# EAGLE schematic test_1 (EAGLE 7.0.0)

## Sheet 1 of 13
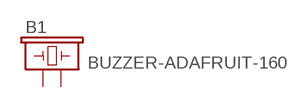
[diagram p0: schematic, sheet 1]

### Parts
B1  BUZZER-ADAFRUIT-160  [BUZZER-12MM-ADAFRUIT-160]

### Nets
2_0_buzzer: B1.- ; also sheet 2,3,4,6,7,8,9,10,11,12,13
D3_7_brain: B1.+ ; also sheet 8

## Sheet 2 of 13
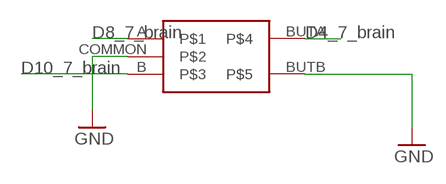
[diagram p1: schematic, sheet 2]

### Parts
U4  ROTARY-ENCODER-W/BUTTON-ADAFRUIT377  [ROTARY-ENCODER-W/BUTTON-ADAFRUIT377]

### Nets
2_0_buzzer: U4.BUTB U4.COMMON ; supply symbol labelled GND ; also sheet 1,3,4,6,7,8,9,10,11,12,13
D4_7_brain: U4.BUTA ; also sheet 8
D8_7_brain: U4.A ; also sheet 8
D10_7_brain: U4.B ; also sheet 8

## Sheet 3 of 13
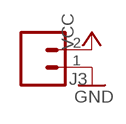
[diagram p2: schematic, sheet 3]

### Parts
J3  HEADER-0.1IN-2POS-FEMALE  [HDRV2W63P254_2X1_508X254H838_HS]

### Nets
2_0_buzzer: J3.1 ; supply symbol labelled GND ; also sheet 1,2,4,6,7,8,9,10,11,12,13
+5V_7_brain: J3.2 ; supply symbol labelled VCC ; also sheet 5,8,9,10,12

## Sheet 4 of 13
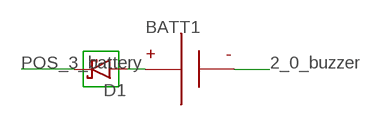
[diagram p3: schematic, sheet 4]

### Parts
BATT1  BATTERY-9V-VERTICAL  [BATTERY_9V_KEYSTONE_968]
D1  RESOLVED-DIODE-SCHOTTKY_TH-DO-41-AND-DO-204AL  [DIOAD1125W78L520D270_HS]

### Nets
2_0_buzzer: BATT1.N ; also sheet 1,2,3,6,7,8,9,10,11,12,13
N$1_3_battery: BATT1.P D1.A
POS_3_battery: D1.C ; also sheet 8

## Sheet 5 of 13
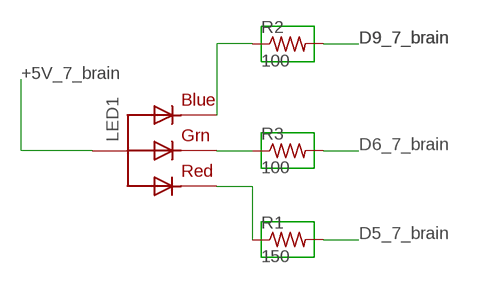
[diagram p4: schematic, sheet 5]

### Parts
LED1  RGBLED_CA-5MM  [LED5MMRGB]
R1  150  RESOLVED-RESISTOR_TH-1/6W-CARBON  [RESAD770W45L370D210_HS]
R2  100  RESOLVED-RESISTOR_TH-1/6W-CARBON  [RESAD770W45L370D210_HS]
R3  100  RESOLVED-RESISTOR_TH-1/6W-CARBON  [RESAD770W45L370D210_HS]

### Nets
+5V_7_brain: LED1.2(VCC) ; also sheet 3,8,9,10,12
D5_7_brain: R1.2 ; also sheet 8
D6_7_brain: R3.2 ; also sheet 8
D9_7_brain: R2.2 ; also sheet 8
N$1_4_led_2: LED1.4(BLUE) R2.1
N$2_4_led_2: LED1.3(GREEN) R3.1
N$3_4_led_2: LED1.1(RED) R1.1

## Sheet 6 of 13
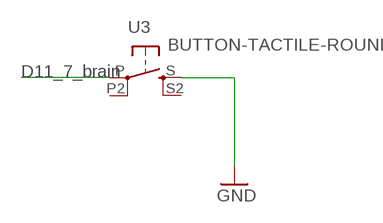
[diagram p5: schematic, sheet 6]

### Parts
U3  BUTTON-TACTILE-ROUND  [BUTTON-TACTILE-ROUND-ADAFRUIT1009]

### Nets
2_0_buzzer: U3.S ; supply symbol labelled GND ; also sheet 1,2,3,4,7,8,9,10,11,12,13
D11_7_brain: U3.P ; also sheet 8
Unconnected: U3.P2(P1) U3.S2(S1)

## Sheet 7 of 13
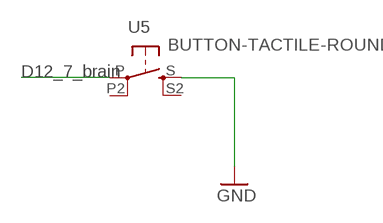
[diagram p6: schematic, sheet 7]

### Parts
U5  BUTTON-TACTILE-ROUND  [BUTTON-TACTILE-ROUND-ADAFRUIT1009]

### Nets
2_0_buzzer: U5.S ; supply symbol labelled GND ; also sheet 1,2,3,4,6,8,9,10,11,12,13
D12_7_brain: U5.P ; also sheet 8
Unconnected: U5.P2(P1) U5.S2(S1)

## Sheet 8 of 13
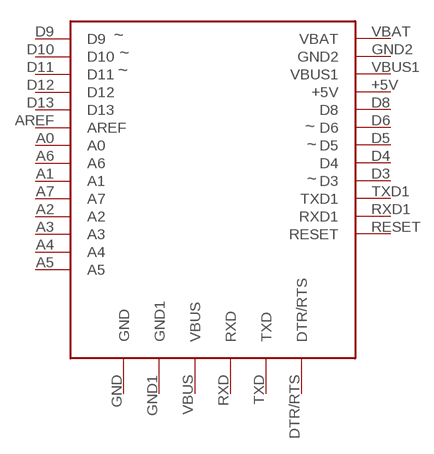
[diagram p7: schematic, sheet 8]

### Parts
U2  ADAFRUIT-PRO-TRINKET-5V-BOB  [ADAFRUIT-PRO-TRINKET-5V]

### Nets
2_0_buzzer: U2.GND U2.GND1 U2.GND2 ; also sheet 1,2,3,4,6,7,9,10,11,12,13
+5V_7_brain: U2.+5V ; also sheet 3,5,9,10,12
A0_7_brain: U2.A0 ; also sheet 13
A1_7_brain: U2.A1 ; also sheet 10
A2_7_brain: U2.A2 ; also sheet 10
A3_7_brain: U2.A3 ; also sheet 11
A4_7_brain: U2.A4 ; also sheet 12
A5_7_brain: U2.A5 ; also sheet 12
A6_7_brain: U2.A6
A7_7_brain: U2.A7
AREF_7_brain: U2.AREF
D3_7_brain: U2.D3 ; also sheet 1
D4_7_brain: U2.D4 ; also sheet 2
D5_7_brain: U2.D5 ; also sheet 5
D6_7_brain: U2.D6 ; also sheet 5
D8_7_brain: U2.D8 ; also sheet 2
D9_7_brain: U2.D9 ; also sheet 5
D10_7_brain: U2.D10 ; also sheet 2
D11_7_brain: U2.D11 ; also sheet 6
D12_7_brain: U2.D12 ; also sheet 7
D13_7_brain: U2.D13 ; also sheet 10
DTR/RTS_7_brain: U2.DTR/RTS
POS_3_battery: U2.VBAT ; also sheet 4
RESET_7_brain: U2.RESET
RXD1_7_brain: U2.RXD1
RXD_7_brain: U2.RXD
TXD1_7_brain: U2.TXD1
TXD_7_brain: U2.TXD
VBUS1_7_brain: U2.VBUS1
VBUS_7_brain: U2.VBUS

## Sheet 9 of 13
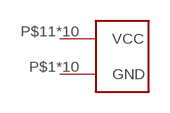
[diagram p8: schematic, sheet 9]

### Parts
U1  PROTO-AREA-10X10  [PROTO-AREA-10X10]

### Nets
2_0_buzzer: U1.P$1(GND) U1.P$2(GND) U1.P$3(GND) U1.P$4(GND) U1.P$5(GND) U1.P$6(GND) U1.P$7(GND) U1.P$8(GND) U1.P$9(GND) U1.P$10(GND) ; also sheet 1,2,3,4,6,7,8,10,11,12,13
+5V_7_brain: U1.P$11(VCC) U1.P$12(VCC) U1.P$13(VCC) U1.P$14(VCC) U1.P$15(VCC) U1.P$16(VCC) U1.P$17(VCC) U1.P$18(VCC) U1.P$19(VCC) U1.P$20(VCC) ; also sheet 3,5,8,10,12

## Sheet 10 of 13
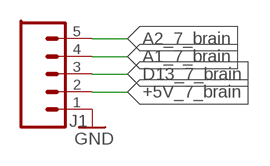
[diagram p9: schematic, sheet 10]

### Parts
J1  HEADER-0.1IN-5POS-FEMALE  [HDRV5W63P254_5X1_1270X254H838_HS]

### Nets
2_0_buzzer: J1.1 ; supply symbol labelled GND ; also sheet 1,2,3,4,6,7,8,9,11,12,13
+5V_7_brain: J1.2 ; also sheet 3,5,8,9,12
A1_7_brain: J1.4 ; also sheet 8
A2_7_brain: J1.5 ; also sheet 8
D13_7_brain: J1.3 ; also sheet 8

## Sheet 11 of 13
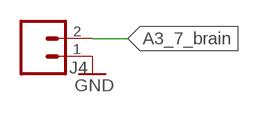
[diagram p10: schematic, sheet 11]

### Parts
J4  HEADER-0.1IN-2POS-FEMALE  [HDRV2W63P254_2X1_508X254H838_HS]

### Nets
2_0_buzzer: J4.1 ; supply symbol labelled GND ; also sheet 1,2,3,4,6,7,8,9,10,12,13
A3_7_brain: J4.2 ; also sheet 8

## Sheet 12 of 13
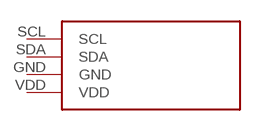
[diagram p11: schematic, sheet 12]

### Parts
U6  ADAFRUIT-7SEG-BACKPACK-RED  [ADAFRUIT-7SEG-BACKPACK]

### Nets
2_0_buzzer: U6.GND ; also sheet 1,2,3,4,6,7,8,9,10,11,13
+5V_7_brain: U6.VDD ; also sheet 3,5,8,9,10
A4_7_brain: U6.SDA ; also sheet 8
A5_7_brain: U6.SCL ; also sheet 8

## Sheet 13 of 13
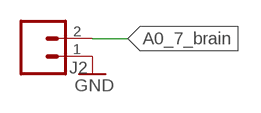
[diagram p12: schematic, sheet 13]

### Parts
J2  HEADER-0.1IN-2POS-FEMALE  [HDRV2W63P254_2X1_508X254H838_HS]

### Nets
2_0_buzzer: J2.1 ; supply symbol labelled GND ; also sheet 1,2,3,4,6,7,8,9,10,11,12
A0_7_brain: J2.2 ; also sheet 8

## Library data of the parts
B1 = Components:BUZZER: Buzzer 12mm Spark Fun Electronics SKU : Comp-Buzzer; DIST: Adafruit; DISTPN: 160; HIERARCHY_NAME: buzzer.u1
BATT1 = Components:BATTERY; DIST: Digikey; DISTPN: 36-968-ND; HIERARCHY_NAME: battery.BATT1
D1 = KoalaBuild:RESOLVED-DIODE-SCHOTTKY_: Schottky diode; DATASHEET: http://www.st.com/web/en/resource/technical/document/datasheet/CD00001625.pdf; DATA_SHEET: http://www.st.com/web/en/resource/technical/document/datasheet/CD00001625.pdf; DB: /Users/swanson/research/NVSL/src/with-git/gtron_devel/Gadgets/Tools/Koala/Koala/PartLibrary/Digikey/Schottky-Diodes-TH.csv; DEVICE: TH-DO-41-AND-DO-204AL; DIST: Digikey; DISTPN: 497-4547-1-ND; HIERARCHY_NAME: battery.D1; IMAGE: http://media.digikey.com/photos/STMicro%20Photos/1N5819.JPG; IRECT: 1A; MFR: STMicroelectronics; MIN_QTY: 1; MPN: 1N5817; PACKAGE: DIOAD1125W78L520D270_HS; PRICE: $0.57; SIZE: TH; STOCK: STOCK; VALUE: 450mV; VREV: 20V
J1 = Components:HEADER-0.1IN-5POS: 5 pin single inline pin header, socket, or connector; DIST: Digikey; DISTPN: S6103-ND; HIERARCHY_NAME: digital_2.J1; PIN1: GND; PIN2: D1; PIN3: D2; PIN4: D3; PIN5: D4
J2 = Components:HEADER-0.1IN-2POS: 2 pin single inline pin header, socket, or connector; DIST: Digikey; DISTPN: S7000-ND; HIERARCHY_NAME: analog.J1; PIN1: GND; PIN2: A1
J3 = Components:HEADER-0.1IN-2POS: 2 pin single inline pin header, socket, or connector; DIST: Digikey; DISTPN: S7000-ND; HIERARCHY_NAME: power.J1; PIN1: GND; PIN2: VDD
J4 = Components:HEADER-0.1IN-2POS: 2 pin single inline pin header, socket, or connector; DIST: Digikey; DISTPN: S7000-ND; HIERARCHY_NAME: digital.J1; PIN1: GND; PIN2: D1
LED1 = Components:RGBLED_CA: RGB LED, common-anode 5MM Staggered pins 5mm Piranha package http://www.ladyada.net/library/pcb/eaglelibrary.html; DIST: Adafruit; DISTPN: 302; HIERARCHY_NAME: led_2.LED1
R1 = KoalaBuild:RESOLVED-RESISTOR_: Resistor; CASE: TH; DATASHEET: http://www.yageo.com/NewPortal/yageodocoutput?fileName=/pdf/throughhole/Yageo_LR_CFR_2013.pdf; DATA_SHEET: http://www.yageo.com/NewPortal/yageodocoutput?fileName=/pdf/throughhole/Yageo_LR_CFR_2013.pdf; DB: /Users/swanson/research/NVSL/src/with-git/gtron_devel/Gadgets/Tools/Koala/Koala/PartLibrary/Digikey/Resistors-TH.csv; DEVICE: TH-1/6W-CARBON; DIST: Digikey; DISTPN: 150EBK-ND; HIERARCHY_NAME: led_2.U$3; IMAGE: http://media.digikey.com/Renders/Yageo%20Renders/CFR-12JR-150R.jpg; MFR: Yageo; MIN_QTY: 1; MPN: CFR-12JB-52-150R; PACKAGE: RESAD770W45L370D210_HS; PRICE: $0.10; PWR: 167mW; SIZE: TH; STOCK: STOCK; TOL: 5%; VALUE_QUERY: 150
R2 = KoalaBuild:RESOLVED-RESISTOR_: Resistor; CASE: TH; DATASHEET: http://www.yageo.com/NewPortal/yageodocoutput?fileName=/pdf/throughhole/Yageo_LR_CFR_2013.pdf; DATA_SHEET: http://www.yageo.com/NewPortal/yageodocoutput?fileName=/pdf/throughhole/Yageo_LR_CFR_2013.pdf; DB: /Users/swanson/research/NVSL/src/with-git/gtron_devel/Gadgets/Tools/Koala/Koala/PartLibrary/Digikey/Resistors-TH.csv; DEVICE: TH-1/6W-CARBON; DIST: Digikey; DISTPN: 100EBK-ND; HIERARCHY_NAME: led_2.U$1; IMAGE: http://media.digikey.com/Renders/Yageo%20Renders/CFR-12JR-100R.jpg; MFR: Yageo; MIN_QTY: 1; MPN: CFR-12JB-52-100R; PACKAGE: RESAD770W45L370D210_HS; PRICE: $0.10; PWR: 167mW; SIZE: TH; STOCK: STOCK; TOL: 5%; VALUE_QUERY: 100
R3 = KoalaBuild:RESOLVED-RESISTOR_: Resistor; CASE: TH; DATASHEET: http://www.yageo.com/NewPortal/yageodocoutput?fileName=/pdf/throughhole/Yageo_LR_CFR_2013.pdf; DATA_SHEET: http://www.yageo.com/NewPortal/yageodocoutput?fileName=/pdf/throughhole/Yageo_LR_CFR_2013.pdf; DB: /Users/swanson/research/NVSL/src/with-git/gtron_devel/Gadgets/Tools/Koala/Koala/PartLibrary/Digikey/Resistors-TH.csv; DEVICE: TH-1/6W-CARBON; DIST: Digikey; DISTPN: 100EBK-ND; HIERARCHY_NAME: led_2.U$2; IMAGE: http://media.digikey.com/Renders/Yageo%20Renders/CFR-12JR-100R.jpg; MFR: Yageo; MIN_QTY: 1; MPN: CFR-12JB-52-100R; PACKAGE: RESAD770W45L370D210_HS; PRICE: $0.10; PWR: 167mW; SIZE: TH; STOCK: STOCK; TOL: 5%; VALUE_QUERY: 100
U1 = Components:PROTO-AREA; DIST: Gadgetron; DISTPN: proto-area-10x10; HIERARCHY_NAME: proto_area.u1
U2 = BOBs:ADAFRUIT-PRO-TRINKET-5V: Adafruit Pro Trinket - 5V 16MHz; DIST: Adafruit; DISTPN: 2000; HIERARCHY_NAME: brain.U1
U3 = Components:BUTTON-TACTILE; DIST: Adafruit; DISTPN: 1009; HIERARCHY_NAME: button.B1
U4 = Components:ROTARY-ENCODER-W/BUTTON-ADAFRUIT377; DIST: Adafruit; DISTPN: 377; HIERARCHY_NAME: knob.U1
U5 = Components:BUTTON-TACTILE; DIST: Adafruit; DISTPN: 1009; HIERARCHY_NAME: button_2.B1
U6 = BOBs:ADAFRUIT-7SEG-BACKPACK: Adafruit 0.56in 4-Digit 7-Segment Display w/I2C Backpack; DIST: Adafruit; DISTPN: 878; HIERARCHY_NAME: display.u1